# EAGLE design mice poke simple v1.2 (EAGLE 6.5.0)
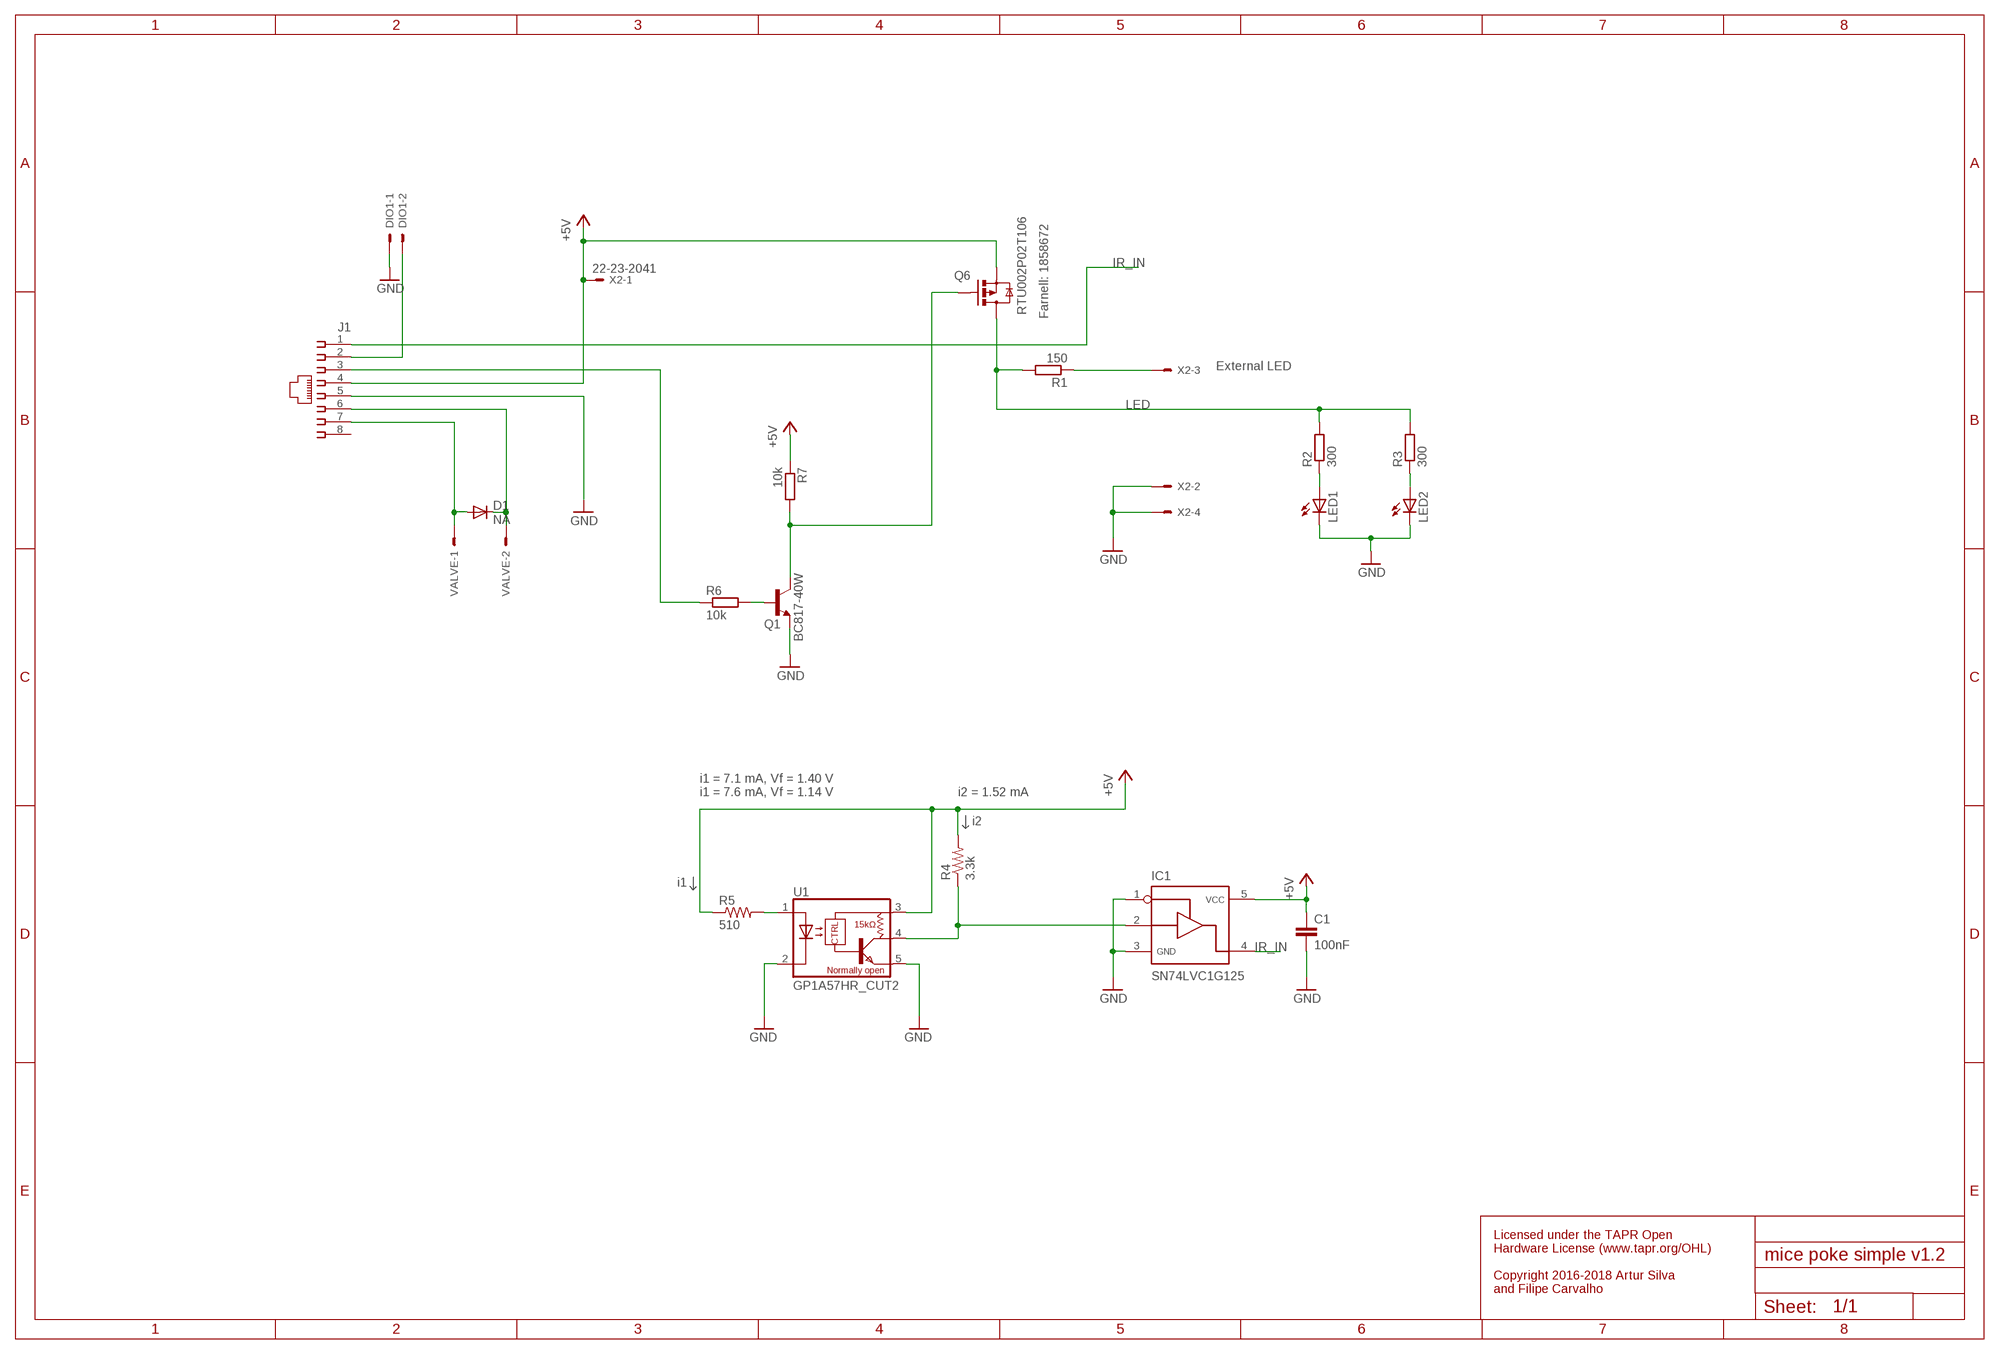
[diagram p0: schematic, sheet 1]

## Parts
C1  100nF  C-EUC0402  [C0402]
D1  NA  DIODE-SOD323-R  [SOD323-R]
DIO1  22-23-2021  [22-23-2021]
IC1  SN74LVC1G125  [SOT23-5]
J1  215878-2  [215878-2]
LED1  LED3MM  [LED3MM]
LED2  LED3MM  [LED3MM]
Q1  BC817-40W  BC817  [SOT323-BEC]
Q6  RTU002P02T106  MOSFET-PCHANNEL-ROHM  [SOT323]
R1  150  R-EU_R0402  [R0402]
R2  300  R-EU_R0402  [R0402]
R3  300  R-EU_R0402  [R0402]
R4  3.3k  R-US_R0402  [R0402]
R5  510  R-US_R0402  [R0402]
R6  10k  R-EU_R0402  [R0402]
R7  10k  R-EU_R0402  [R0402]
U1  GP1A57HR_CUT2  [GP1A57HR_CUT2]
VALVE  22-23-2021  [22-23-2021]
X2  22-23-2041  [22-23-2041]

## Nets
+5V: C1.1 IC1.5 J1.4 Q6.1(S) R4.2 R5.1 R7.1 U1.3(VCC) X2.1
GND: C1.2 DIO1.1 IC1.1 IC1.3 J1.5 LED1.K(C) LED2.K(C) Q1.E U1.2(C) U1.5(GND) X2.2 X2.4
IR_IN: IC1.4 J1.1
LED: Q6.3(D) R1.2 R2.2 R3.2
N$2: R1.1 X2.3
N$4: R5.2 U1.1(A)
N$5: D1.A J1.7 VALVE.1
N$6: D1.C J1.6 VALVE.2
N$7: DIO1.2 J1.2
N$8: J1.3 R6.1
N$9: IC1.2 R4.1 U1.4(VO)
N$13: LED2.A R3.1
N$14: LED1.A R2.1
N$18: Q1.C Q6.2(G) R7.2
N$19: Q1.B R6.2
Unconnected: J1.8

## Notes on the sheet
- Farnell: 1858672
- External LED
- i1 = 7.1 mA, Vf = 1.40 V
  i1 = 7.6 mA, Vf = 1.14 V
- i2 = 1.52 mA
- i2
- i1
- Licensed under the TAPR Open 
  Hardware License (www.tapr.org/OHL)
  
  Copyright 2016-2018 Artur Silva
  and Filipe Carvalho

## Library data of the parts
C1 = rcl:C-EU: CAPACITOR, European symbol
D1 = diode:DIODE-: DIODE
DIO1 VALVE = con-molex:22-23-2021: .100" (2.54mm) Center Header - 2 Pin; MF: MOLEX; MPN: 22-23-2021; OC_FARNELL: 1462926; OC_NEWARK: 25C3832
IC1 = My_library 0v2:SN74LVC1G125
J1 = con-amp:215878-2: AMP connector
LED1 LED2 = adafruit:LED: LED OSRAM: - CHIPLED LG R971, LG N971, LY N971, LG Q971, LY Q971, LO R971, LY R971 LH N974, LH R974 LS Q976, LO Q976, LY Q976 LO Q996 - Hyper CHIPLED LW Q18S LB Q993, LB Q99A, LB R99A - SideLED LS A670, LO A670, LY A670, LG A670, LP A670 LB A673, LV A673, LT A673, LW A673 LH A674 LY A675 LS A676, LA A676, LO A676, LY A676, LW A676 LS A679, LY A679, LG A679 - Hyper Micro SIDELED® LS Y876, LA Y876, LO Y876, LY Y876 LT Y87S - SmartLED LW L88C, LW L88S LB L89C, LB L89S, LG L890 LS L89K, LO L89K, LY L89K LS L896, LA L896, LO L896, LY L896 - TOPLED LS T670, LO T670, LY T670, LG T670, LP T670 LSG T670, LSP T670, LSY T670, LOP T670, LYG T670 LG T671, LOG T671, LSG T671 LB T673, LV T673, LT T673, LW T673 LH T674 LS T676, LA T676, LO T676, LY T676, LB T676, LH T676, LSB T676, LW T676 LB T67C, LV T67C, LT T67C, LS T67K, LO T67K, LY T67K, LW E67C LS E67B, LA E67B, LO E67B, LY E67B, LB E67C, LV E67C, LT E67C LW T67C LS T679, LY T679, LG T679 LS T770, LO T770, LY T770, LG T770, LP T770 LB T773, LV T773, LT T773, LW T773 LH T774 LS E675, LA E675, LY E675, LS T675 LS T776, LA T776, LO T776, LY T776, LB T776 LHGB T686 LT T68C, LB T68C - Hyper Mini TOPLED® LB M676 - Mini TOPLED Santana® LG M470 LS M47K, LO M47K, LY M47K Source: http://www.osram.convergy.de/
Q1 = transistor-npn:BC817*: NPN Transistor
Q6 = MOSFET:MOSFET-PCHANNEL-ROHM: PMOS (RTU002P02) Low On-Resistance. Low Gate Threshold Voltage. Low Input Capacitance. Fast Switching Speed. Manufacturer: ROHM
R1-R3 R6 R7 = rcl:R-EU_: RESISTOR, European symbol
R4 R5 = rcl:R-US_: RESISTOR, American symbol
U1 = CNP-miscellaneous:GP1A57HR
X2 = con-molex:22-23-2041: .100" (2.54mm) Center Header - 4 Pin; MF: MOLEX; MPN: 22-23-2041; OC_FARNELL: 1462920; OC_NEWARK: 38C0355

## Board
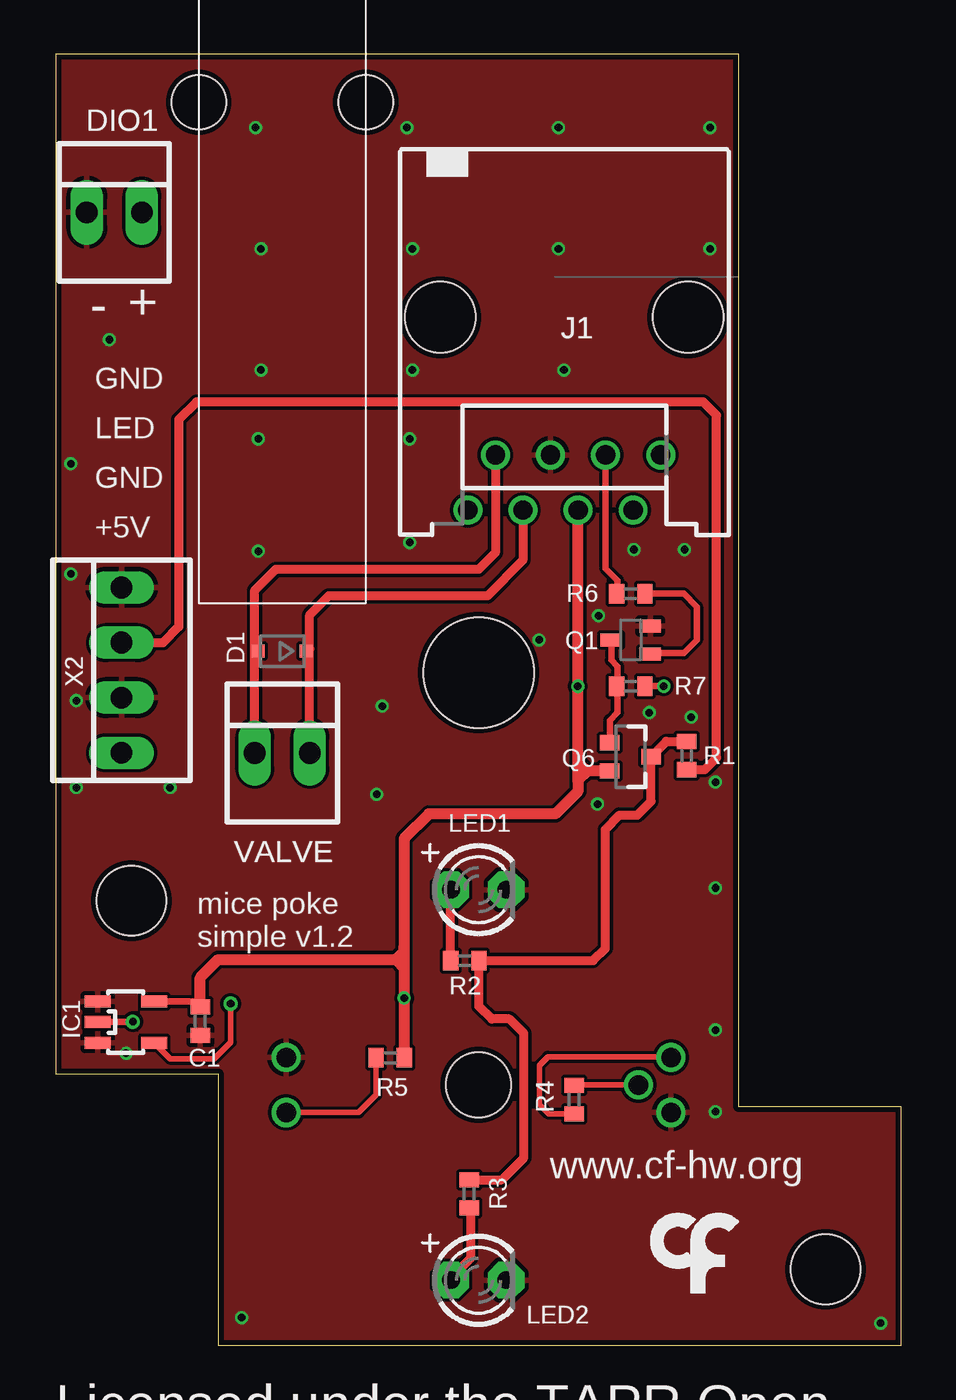
[diagram p1: board, top side]
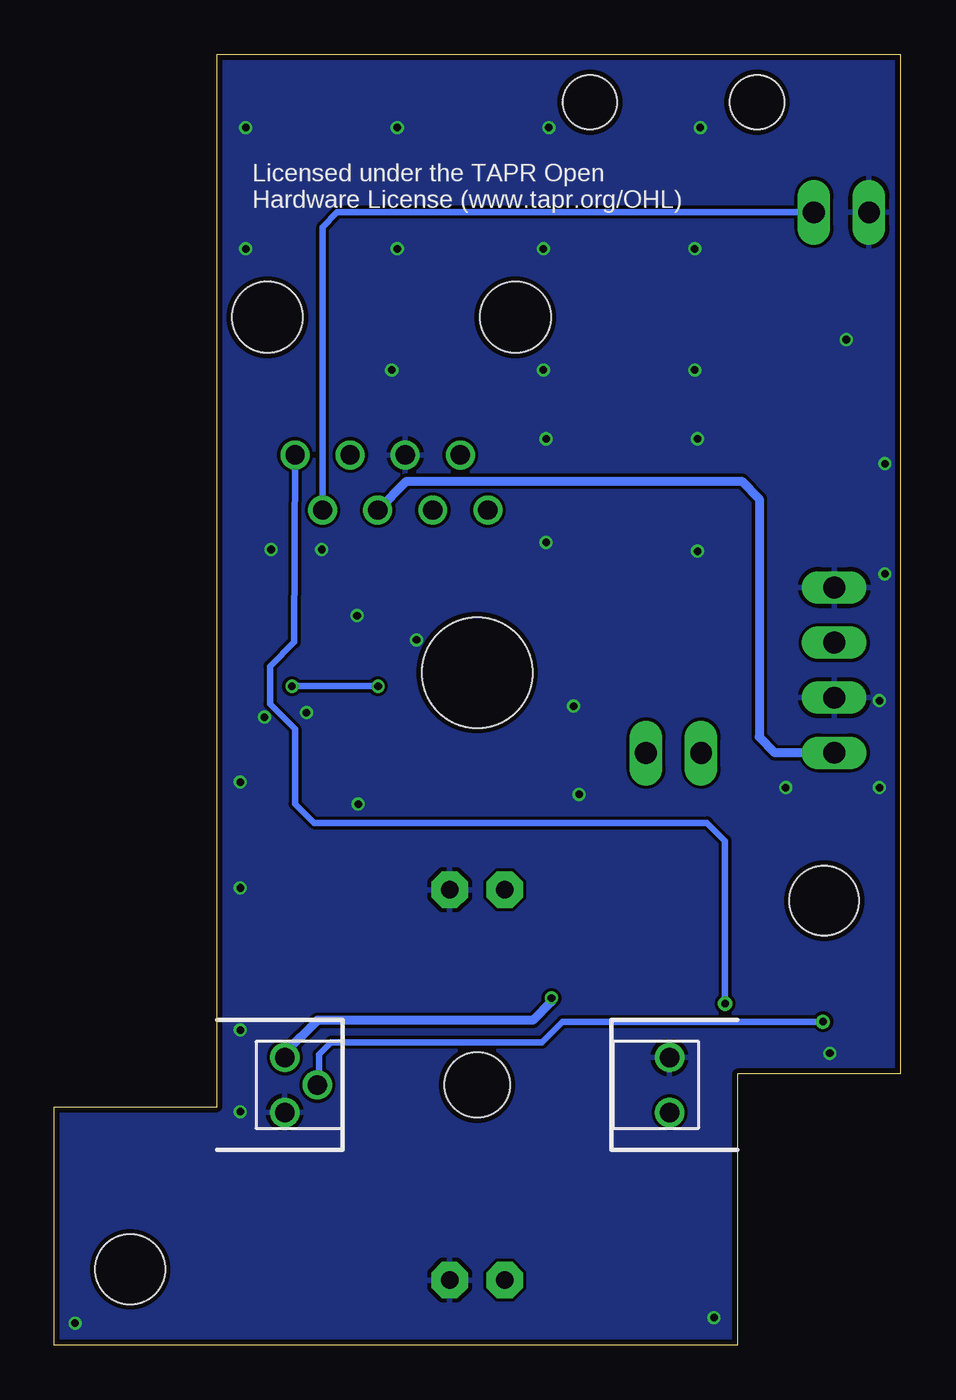
[diagram p2: board, bottom side, seen from below]

Size 39 x 59.51 mm. Coordinates in mm from the lower left corner, seen from the top.
Outline: 7.5,0 39,0 39,10.99 31.5,10.99 31.5,25.73 31.49,25.73 31.49,59.51 0,59.51 0,12.5 7.5,12.5 7.5,0
Copper layers (1*16): Top 0.018mm / dielectric 1.55mm / Bottom 0.018mm
Design rules "eC_2Layer_PClass6_BaseCopperO18_eCDefault *": minimum track width 0.15mm, minimum drill 0.35mm, track to track 0.15mm, track to pad 0.15mm, pad to pad 0.15mm, via to via 0.15mm, smd to smd 0mil, copper to edge 0.25mm, drill to drill 0.35mm, minimum pad ring 0.175mm, minimum via ring 0.125mm, stop-mask expansion 0mil, vias tented up to drill 0.45mm, thermal gap 0.2mm
Holes 3 mm at 19.5,12
Holes 3.2 mm at 35.5,3.5 3.5,20.5
Holes 5.08 mm at 19.5,31
Holes 2.5 mm at 14.3,57.3 6.6,57.3

### Footprints (pad centres in the part's own frame; a part is rotated, then mirrored left to right if it is on the bottom)
C0402 = smd 0.7 x 0.9: 1 -0.65,0; 2 0.65,0
SOD323-R = smd 0.6 x 0.6: A 1.1,0; C -1.1,0
22-23-2021 = drill 1 long: 1 -1.27,0; 2 1.27,0
SOT23-5 = smd 0.55 x 1.2: 1 -0.95,-1.3; 2 0,-1.3; 3 0.95,-1.3; 4 0.95,1.3; 5 -0.95,1.3
215878-2 = drill 0.889: 1 -4.445,6.35; 2 -3.175,8.89; 3 -1.905,6.35; 4 -0.635,8.89; 5 0.635,6.35; 6 1.905,8.89; 7 3.175,6.35; 8 4.445,8.89 | hole 3.251: -5.715,0; 5.715,0
LED3MM = drill 0.813 pad 1.676 octagon: A -1.27,0; K 1.27,0
SOT323-BEC = smd 0.6 x 1: B -0.65,-0.9; C 0,0.9; E 0.65,-0.9
SOT323 = smd 0.7 x 0.9: 1 0.65,-0.95; 2 -0.65,-0.95; 3 0,0.95
R0402 = smd 0.7 x 0.9: 1 -0.65,0; 2 0.65,0
GP1A57HR_CUT2 = drill 0.9: 1 1.27,8.87; 2 -1.27,8.87; 3 -1.27,-8.87; 4 0,-7.37; 5 1.27,-8.87
22-23-2041 = drill 1 long: 1 -3.81,0; 2 -1.27,0; 3 1.27,0; 4 3.81,0

### Placement (x,y rotation side)
C1  6.67,14.94 270 top
D1  10.45,31.99 180 top
DIO1  2.71,52.22 0 top
IC1  3.24,14.9 270 top
J1  23.45,47.39 180 top
LED1  19.5,21 0 top
LED2  19.5,3 0 top
Q1  26.52,32.51 90 top
Q6  26.5,27.13 270 top
R1  29.09,27.18 90 top
R2  18.87,17.73 0 top
R3  19.06,6.98 90 top
R4  23.9,11.32 270 top
R5  15.43,13.25 180 top
R6  26.52,34.65 0 top
R7  26.52,30.38 180 top
U1  19.5,12 270 bottom
U$2  [LOGO_7]  28.64,4.83 0 top
VALVE  10.45,27.3 0 top
X2  3.04,31.12 90 top

### Tracks (layer width: path | path; a pad name or v marks a point on that pad's centre or on a via)
+5V  (via drill 0.35)
  Top 0.254: R4.2 22.73,10.67 22.3,11.1 22.3,12.9 22.7,13.3 28.04,13.3 U1.3
  Top 0.305: IC1.5 6.67,15.85 C1.1 | 24.51,26.48 24.51,26.57 24.43,26.57 | R7.1 v28.04,30.38
  Top 0.406: 16.05,13.23 R5.1
  Top 0.457: 24.08,27.48 24.08,26.92 24.43,26.57
  Top 0.508: C1.1 6.67,16.95 7.5,17.78 15.69,17.78 | 16.07,17.78 16.07,23.36 17.21,24.5 23.04,24.5 24.07,25.53 24.07,26.04 24.11,26.08 | 16.07,17.78 v16.07,16 R5.1 | 15.69,17.78 16.07,17.78 | 15.69,17.78 16.07,18.16 16.07,18.41 | 15.69,17.78 16.07,17.4 16.07,17.27 | Q6.1 24.51,26.48 24.11,26.08 | J1.4 24.07,38.48 v24.07,30.38 24.07,26.08 24.11,26.08
  Bottom 0.305: v28.04,30.38 v24.07,30.38
  Bottom 0.406: U1.3 28.37,13.48 26.87,14.99 16.94,14.99 16.07,15.85 v16.07,16 | J1.4 22.75,39.83 7.31,39.83 6.5,39.01 6.5,28.04 5.77,27.31 X2.1
GND  (via drill 0.35)
  other vias: 14.8,25.4 22.29,32.51 8.58,1.27 38.04,1.02 30.17,50.55 16.32,37.01 16.45,50.55 30.42,21.08 30.42,14.53 30.42,10.77 0.7,40.64 0.7,35.56 0.96,29.72 0.96,25.7 3.24,13.46 24.99,24.94 30.42,25.96 29.3,28.96 30.17,56.13 23.18,56.13 16.2,56.13 23.18,50.55 9.21,56.13 9.47,50.55 9.47,44.96 16.45,44.96 23.44,44.96 2.48,46.35 15.05,29.46 5.28,25.7 9.34,41.78 9.34,36.6 16.32,41.78 25.04,33.63 26.66,36.68 29,36.68 27.37,29.16
  pour Top (rank 2): 0,59.39 31.5,59.39 31.5,11 39,11 39,0 7.5,0 7.5,12.5 0,12.5
  pour Bottom: 0,59.39 31.5,59.39 31.5,11 39,11 39,0 7.5,0 7.5,12.5 0,12.5
IR_IN  (via drill 0.35 pad 0.65)
  Top 0.254: IC1.4 4.79,13.69 5.28,13.21 7.31,13.21 8.07,13.97 v8.07,15.75
  Bottom 0.305: v8.07,15.75 8.07,23.25 8.9,24.08 27.02,24.08 27.9,24.96 27.9,28.41 29.06,29.57 29.06,31.29 27.94,32.41 J1.1
LED
  Top 0.406: R3.2 20.57,7.63 21.59,8.65 21.59,14.37 20.92,15.04 20.11,15.04 19.52,15.63 R2.2 24.78,17.73 25.34,18.29 25.34,23.77 26,24.43 26.82,24.43 27.45,25.07 Q6.3 28.16,27.83 R1.2
N$2
  Top 0.406: R1.1 29.93,26.53 30.47,27.08 30.47,42.88 29.86,43.48 6.5,43.48 5.68,42.67 5.68,33.12 4.95,32.39 X2.3
N$4
  Top 0.254: U1.1 13.97,10.73 14.78,11.53 R5.2
N$5
  Top 0.254: D1.A 9.18,32 9.18,32.51
  Top 0.406: J1.7 20.28,36.54 19.5,35.76 10.15,35.76 9.18,34.79 9.18,32.51 VALVE.1
N$6
  Top 0.254: D1.C 11.72,32 11.72,32.11
  Top 0.406: J1.6 21.55,36.19 19.91,34.54 12.59,34.54 11.72,33.67 11.72,32.11 VALVE.2
N$7
  Bottom 0.305: J1.2 26.63,51.55 25.95,52.22 DIO1.2
N$8
  Top 0.305: J1.3 25.36,35.81 25.91,35.26 25.91,34.69 R6.1
N$9  (via drill 0.35 pad 0.65)
  Top 0.254: 23.93,12 U1.4
  Top 0.305: v3.56,14.91 3.32,14.9 IC1.2
  Top 0.406: 23.93,12 R4.1
  Bottom 0.305: v3.56,14.91 15.56,14.91 16.5,13.97 26.23,13.97 26.8,13.4 26.8,12.07 U1.4
N$13
  Top 0.406: R3.1 19.12,6.35 19.12,4 18.17,3.06 LED2.A
N$14
  Top 0.406: R2.1 18.21,20.98 LED1.A
N$18
  Top 0.305: Q1.C 25.62,31.58 25.91,31.29 25.91,30.42 R7.2 25.91,30.34 25.91,29.16 25.55,28.8 Q6.2
N$19
  Top 0.305: R6.2 28.96,34.65 29.57,34.04 29.57,32.51 28.96,31.9 27.46,31.9 Q1.B

### Text on the board
tPlace: - | + | GND | LED | GND | +5V | mice poke / simple v1.2 | www.cf-hw.org | Licensed under the TAPR Open / Hardware License (www.tapr.org/OHL) / / Copyright 2016-2018 Artur Silva and Filipe Carvalho
bPlace: Licensed under the TAPR Open / Hardware License (www.tapr.org/OHL)
_tNames: DIO1 | J1 | R6 | D1 | Q1 | X2 | R7 | Q6 | R1 | LED1 | VALVE | IC1 | R2 | C1 | R5 | R4 | R3 | LED2